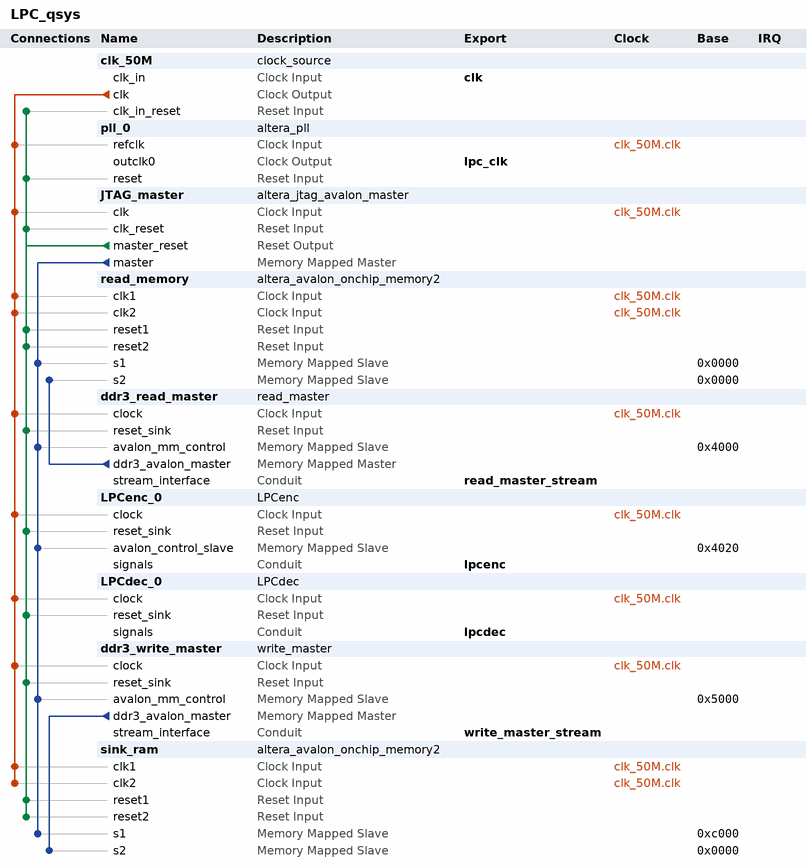
[diagram p0: system contents]
# Platform Designer (Qsys) system LPC_qsys, Cyclone V 5CEFA2F23C8
# Parameters at their usual value, and those the tool derives, are not listed.
package require -exact qsys 15.0
create_system LPC_qsys
set_project_property DEVICE_FAMILY {Cyclone V}
set_project_property DEVICE 5CEFA2F23C8

add_instance clk_50M clock_source 15.0
set_instance_parameter_value clk_50M clockFrequency 50000000

add_instance pll_0 altera_pll 15.0
set_instance_parameter_value pll_0 gui_device_speed_grade 1
set_instance_parameter_value pll_0 gui_number_of_clocks 1
set_instance_parameter_value pll_0 gui_operation_mode direct
set_instance_parameter_value pll_0 gui_output_clock_frequency0 0.8
set_instance_parameter_value pll_0 gui_pll_mode {Fractional-N PLL}
set_instance_parameter_value pll_0 gui_reference_clock_frequency 50.0
set_instance_parameter_value pll_0 gui_use_locked true

add_instance JTAG_master altera_jtag_avalon_master 15.0

add_instance read_memory altera_avalon_onchip_memory2 15.0
set_instance_parameter_value read_memory dataWidth 16
set_instance_parameter_value read_memory dualPort true
set_instance_parameter_value read_memory initMemContent true
set_instance_parameter_value read_memory initializationFileName onchip_mem.hex
set_instance_parameter_value read_memory memorySize 16383

add_instance ddr3_read_master read_master 1.0
set_instance_parameter_value ddr3_read_master S0 0
set_instance_parameter_value ddr3_read_master S1 1
set_instance_parameter_value ddr3_read_master S2 2
set_instance_parameter_value ddr3_read_master S3 3
set_instance_parameter_value ddr3_read_master S4 4
set_instance_parameter_value ddr3_read_master S5 5
set_instance_parameter_value ddr3_read_master S6 6

add_instance LPCenc_0 LPCenc 1.0
set_instance_parameter_value LPCenc_0 S0 0
set_instance_parameter_value LPCenc_0 S1 1
set_instance_parameter_value LPCenc_0 S2 2
set_instance_parameter_value LPCenc_0 S3 3
set_instance_parameter_value LPCenc_0 S4 4
set_instance_parameter_value LPCenc_0 S5 5

add_instance LPCdec_0 LPCdec 1.0

add_instance ddr3_write_master write_master 1.0
set_instance_parameter_value ddr3_write_master S0 0
set_instance_parameter_value ddr3_write_master S1 1
set_instance_parameter_value ddr3_write_master S2 2
set_instance_parameter_value ddr3_write_master S3 3
set_instance_parameter_value ddr3_write_master S4 4

add_instance sink_ram altera_avalon_onchip_memory2 15.0
set_instance_parameter_value sink_ram dataWidth 16
set_instance_parameter_value sink_ram dualPort true
set_instance_parameter_value sink_ram initMemContent true
set_instance_parameter_value sink_ram initializationFileName onchip_mem.hex
set_instance_parameter_value sink_ram memorySize 16383

# connections
add_connection clk_50M.clk ddr3_read_master.clock clock
add_connection clk_50M.clk ddr3_write_master.clock clock
add_connection clk_50M.clk JTAG_master.clk clock
add_connection clk_50M.clk LPCdec_0.clock clock
add_connection clk_50M.clk LPCenc_0.clock clock
add_connection clk_50M.clk pll_0.refclk clock
add_connection clk_50M.clk read_memory.clk1 clock
add_connection clk_50M.clk read_memory.clk2 clock
add_connection clk_50M.clk sink_ram.clk1 clock
add_connection clk_50M.clk sink_ram.clk2 clock
add_connection JTAG_master.master_reset clk_50M.clk_in_reset reset
add_connection JTAG_master.master_reset ddr3_read_master.reset_sink reset
add_connection JTAG_master.master_reset ddr3_write_master.reset_sink reset
add_connection JTAG_master.master_reset JTAG_master.clk_reset reset
add_connection JTAG_master.master_reset LPCdec_0.reset_sink reset
add_connection JTAG_master.master_reset LPCenc_0.reset_sink reset
add_connection JTAG_master.master_reset pll_0.reset reset
add_connection JTAG_master.master_reset read_memory.reset1 reset
add_connection JTAG_master.master_reset read_memory.reset2 reset
add_connection JTAG_master.master_reset sink_ram.reset1 reset
add_connection JTAG_master.master_reset sink_ram.reset2 reset
add_connection ddr3_read_master.ddr3_avalon_master read_memory.s2 avalon
set_connection_parameter_value ddr3_read_master.ddr3_avalon_master/read_memory.s2 baseAddress 0x0000
add_connection ddr3_write_master.ddr3_avalon_master sink_ram.s2 avalon
set_connection_parameter_value ddr3_write_master.ddr3_avalon_master/sink_ram.s2 baseAddress 0x0000
add_connection JTAG_master.master ddr3_read_master.avalon_mm_control avalon
set_connection_parameter_value JTAG_master.master/ddr3_read_master.avalon_mm_control baseAddress 0x4000
add_connection JTAG_master.master ddr3_write_master.avalon_mm_control avalon
set_connection_parameter_value JTAG_master.master/ddr3_write_master.avalon_mm_control baseAddress 0x5000
add_connection JTAG_master.master LPCenc_0.avalon_control_slave avalon
set_connection_parameter_value JTAG_master.master/LPCenc_0.avalon_control_slave baseAddress 0x4020
add_connection JTAG_master.master read_memory.s1 avalon
set_connection_parameter_value JTAG_master.master/read_memory.s1 baseAddress 0x0000
add_connection JTAG_master.master sink_ram.s1 avalon
set_connection_parameter_value JTAG_master.master/sink_ram.s1 baseAddress 0xc000

# exported interfaces
add_interface clk clock sink
set_interface_property clk EXPORT_OF clk_50M.clk_in
add_interface lpc_clk clock source
set_interface_property lpc_clk EXPORT_OF pll_0.outclk0
add_interface lpcdec conduit end
set_interface_property lpcdec EXPORT_OF LPCdec_0.signals
add_interface lpcenc conduit end
set_interface_property lpcenc EXPORT_OF LPCenc_0.signals
add_interface read_master_stream conduit end
set_interface_property read_master_stream EXPORT_OF ddr3_read_master.stream_interface
add_interface write_master_stream conduit end
set_interface_property write_master_stream EXPORT_OF ddr3_write_master.stream_interface

set_interconnect_requirement {$system} qsys_mm.clockCrossingAdapter HANDSHAKE
set_interconnect_requirement {$system} qsys_mm.insertDefaultSlave FALSE
set_interconnect_requirement {$system} qsys_mm.maxAdditionalLatency 1

save_system LPC_qsys.qsys
